# EAGLE schematic powerStageC_rev1 (EAGLE 7.1.0)
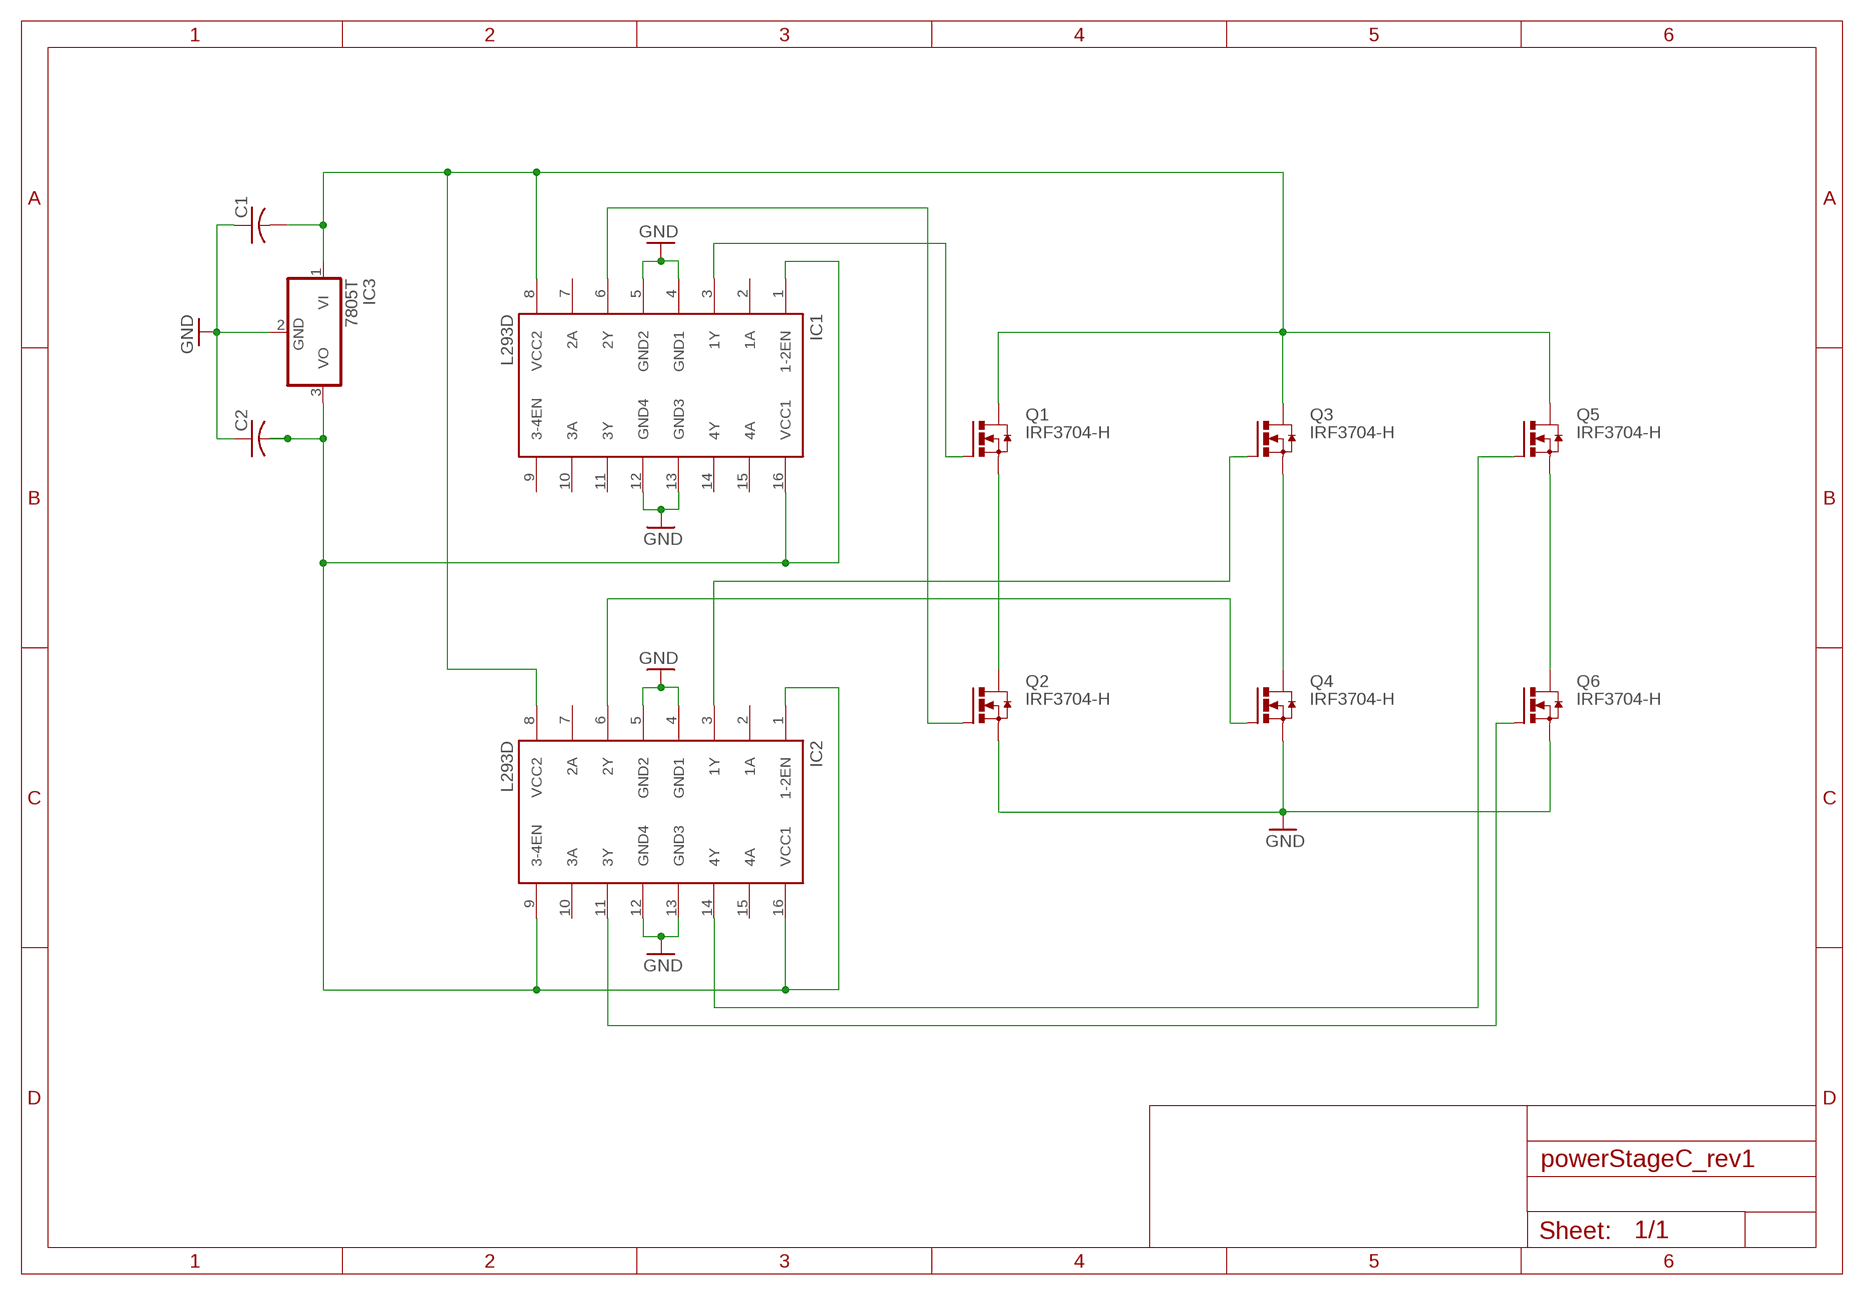
[diagram p0: schematic, sheet 1]

## Parts
C1  C-US025_050-025X075  [C025_050-025X075]
C2  C-US025_050-025X075  [C025_050-025X075]
IC1  L293D  [DIL16]
IC2  L293D  [DIL16]
IC3  7805T  [TO220H]
Q1  IRF3704-H  [TO220BH]
Q2  IRF3704-H  [TO220BH]
Q3  IRF3704-H  [TO220BH]
Q4  IRF3704-H  [TO220BH]
Q5  IRF3704-H  [TO220BH]
Q6  IRF3704-H  [TO220BH]

## Nets
GND: C1.1 C2.1 IC1.4(GND1) IC1.5(GND2) IC1.12(GND4) IC1.13(GND3) IC2.4(GND1) IC2.5(GND2) IC2.12(GND4) IC2.13(GND3) IC3.2(GND) Q2.S Q4.S Q6.S
N$1: C2.2 IC1.1(1-2EN) IC1.16(VCC1) IC2.1(1-2EN) IC2.9(3-4EN) IC2.16(VCC1) IC3.3(VO)
N$2: IC1.3(1Y) Q1.G
N$3: Q1.S Q2.D
N$4: Q3.S Q4.D
N$5: Q5.S Q6.D
N$6: IC1.6(2Y) Q2.G
N$7: IC2.3(1Y) Q3.G
N$8: IC2.11(3Y) Q6.G
N$9: IC2.6(2Y) Q4.G
N$10: IC2.14(4Y) Q5.G
N$12: C1.2 IC1.8(VCC2) IC2.8(VCC2) IC3.1(VI) Q1.D Q3.D Q5.D
Unconnected: IC1.2(1A) IC1.7(2A) IC1.9(3-4EN) IC1.10(3A) IC1.11(3Y) IC1.14(4Y) IC1.15(4A) IC2.2(1A) IC2.7(2A) IC2.10(3A) IC2.15(4A)

## Library data of the parts
C1 C2 = resistor:C-US: CAPACITOR, American symbol
IC1 IC2 = st-microelectronics:L293D: PUSH-PULL 4 CHANNEL DRIVER; MPN: L293D; OC_FARNELL: 9589619; OC_NEWARK: 56P8249
IC3 = linear:78*: Positive VOLTAGE REGULATOR Source: http://cache.national.com/ds/LM/LM78L05.pdf http://www.fairchildsemi.com/ds/LM/LM7805.pdf
Q1-Q6 = transistor-power:IRF3704: SMPS MOSFET HEXFET® Power MOSFET Source: http://www.irf.com/product-info/datasheets/data/irf3704.pdf